# Altium schematic sheet SMI Bank 12.SchDoc
size A3; SheetNumber: 10; SheetTotal: 22
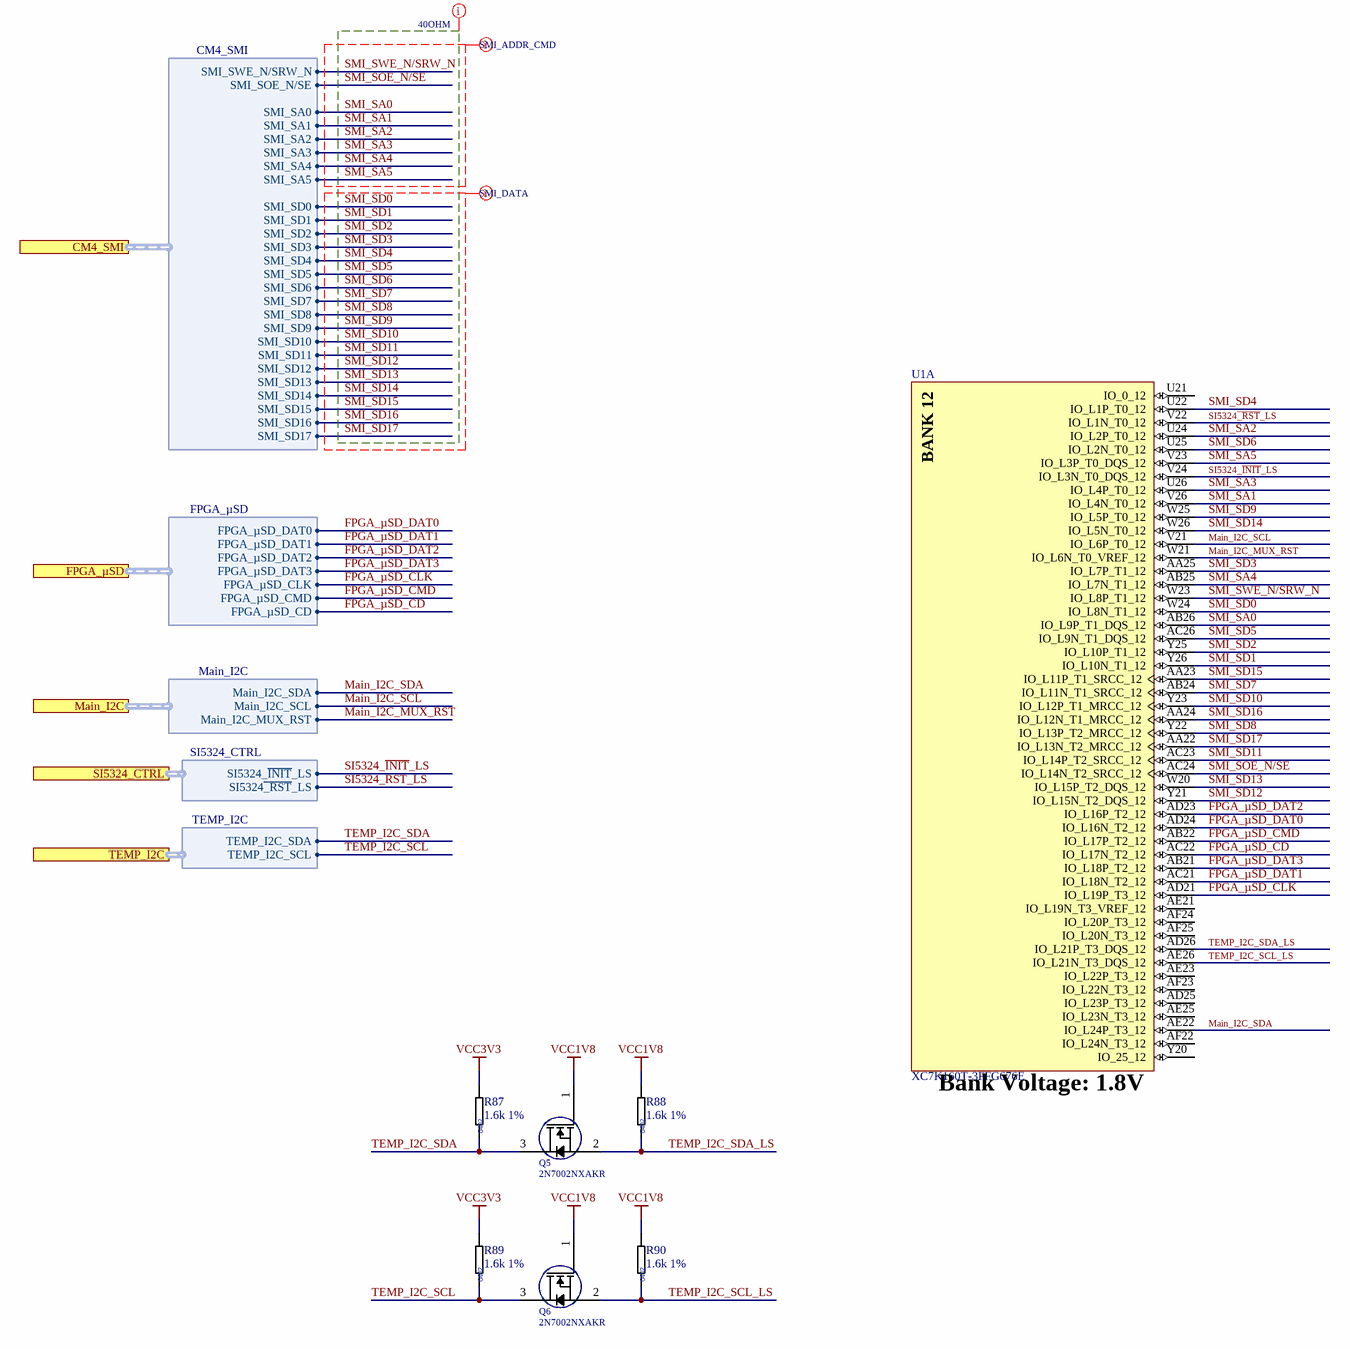
[diagram p0: SMI Bank 12.SchDoc]

## Parts
Q5  2N7002NXAKR  [SOT95P251X112-3N]
Q6  2N7002NXAKR  [SOT95P251X112-3N]
R87  1.6k 1%  [RES_0402_L]
R88  1.6k 1%  [RES_0402_L]
R89  1.6k 1%  [RES_0402_L]
R90  1.6k 1%  [RES_0402_L]
U1  XC7K160T-3FFG676E  [BGA100P2700X2700X317-676N]  (part A of 14)

## Ports
CM4_SMI (harness CM4_SMI, see Top-Level-Sheet[4B], Raspberry Pi CM4[8D]), FPGA_µSD (harness FPGA_µSD, see Top-Level-Sheet[4B], QSPI Flash_eMMC_uSD-Card[1C]), Main_I2C (harness Main_I2C, see Top-Level-Sheet[4B], I2C Multiplexer[1A]), SI5324_CTRL (harness SI5324_CTRL, see Top-Level-Sheet[4B], System Clocks[1A]), TEMP_I2C (harness TEMP_I2C, see Top-Level-Sheet[4B], Buck Modules[1D])

## Harnesses
CM4_SMI: SMI_SOE_N/SE, SMI_SA0, SMI_SD0, SMI_SWE_N/SRW_N, SMI_SA1, SMI_SA2, SMI_SA3, SMI_SA4, SMI_SA5, SMI_SD1, SMI_SD2, SMI_SD3, SMI_SD4, SMI_SD5, SMI_SD6, SMI_SD7, SMI_SD8, SMI_SD9, SMI_SD10, SMI_SD11, SMI_SD12, SMI_SD13, SMI_SD14, SMI_SD15, SMI_SD16, SMI_SD17
FPGA_µSD: FPGA_µSD_DAT0, FPGA_µSD_DAT1, FPGA_µSD_DAT3, FPGA_µSD_CLK, FPGA_µSD_CMD, FPGA_µSD_DAT2, FPGA_µSD_CD
Main_I2C: Main_I2C_SCL, Main_I2C_MUX_RST, Main_I2C_SDA
SI5324_CTRL: SI5324_~{INIT}_LS, SI5324~{_RST}_LS
TEMP_I2C: TEMP_I2C_SCL, TEMP_I2C_SDA

## Nets
VCC1V8: Q5.1(G) Q6.1(G) R88.2 R90.2
VCC3V3: R87.2 R89.2
FPGA_µSD_CD: U1.AC22(IO_L17N_T2_12) ; port FPGA_µSD.FPGA_µSD_CD
FPGA_µSD_CLK: U1.AD21(IO_L19P_T3_12) ; port FPGA_µSD.FPGA_µSD_CLK
FPGA_µSD_CMD: U1.AB22(IO_L17P_T2_12) ; port FPGA_µSD.FPGA_µSD_CMD
FPGA_µSD_DAT0: U1.AD24(IO_L16N_T2_12) ; port FPGA_µSD.FPGA_µSD_DAT0
FPGA_µSD_DAT1: U1.AC21(IO_L18N_T2_12) ; port FPGA_µSD.FPGA_µSD_DAT1
FPGA_µSD_DAT2: U1.AD23(IO_L16P_T2_12) ; port FPGA_µSD.FPGA_µSD_DAT2
FPGA_µSD_DAT3: U1.AB21(IO_L18P_T2_12) ; port FPGA_µSD.FPGA_µSD_DAT3
Main_I2C_MUX_RST: U1.W21(IO_L6N_T0_VREF_12) ; port Main_I2C.Main_I2C_MUX_RST
Main_I2C_SCL: U1.V21(IO_L6P_T0_12) ; port Main_I2C.Main_I2C_SCL
Main_I2C_SDA: U1.AE22(IO_L24P_T3_12) ; port Main_I2C.Main_I2C_SDA
SI5324~{_RST}_LS: U1.V22(IO_L1N_T0_12) ; port SI5324_CTRL.SI5324~{_RST}_LS
SI5324_~{INIT}_LS: U1.V24(IO_L3N_T0_DQS_12) ; port SI5324_CTRL.SI5324_~{INIT}_LS
SMI_SA0: U1.AB26(IO_L9P_T1_DQS_12) ; port CM4_SMI.SMI_SA0
SMI_SA1: U1.V26(IO_L4N_T0_12) ; port CM4_SMI.SMI_SA1
SMI_SA2: U1.U24(IO_L2P_T0_12) ; port CM4_SMI.SMI_SA2
SMI_SA3: U1.U26(IO_L4P_T0_12) ; port CM4_SMI.SMI_SA3
SMI_SA4: U1.AB25(IO_L7N_T1_12) ; port CM4_SMI.SMI_SA4
SMI_SA5: U1.V23(IO_L3P_T0_DQS_12) ; port CM4_SMI.SMI_SA5
SMI_SD0: U1.W24(IO_L8N_T1_12) ; port CM4_SMI.SMI_SD0
SMI_SD1: U1.Y26(IO_L10N_T1_12) ; port CM4_SMI.SMI_SD1
SMI_SD2: U1.Y25(IO_L10P_T1_12) ; port CM4_SMI.SMI_SD2
SMI_SD3: U1.AA25(IO_L7P_T1_12) ; port CM4_SMI.SMI_SD3
SMI_SD4: U1.U22(IO_L1P_T0_12) ; port CM4_SMI.SMI_SD4
SMI_SD5: U1.AC26(IO_L9N_T1_DQS_12) ; port CM4_SMI.SMI_SD5
SMI_SD6: U1.U25(IO_L2N_T0_12) ; port CM4_SMI.SMI_SD6
SMI_SD7: U1.AB24(IO_L11N_T1_SRCC_12) ; port CM4_SMI.SMI_SD7
SMI_SD8: U1.Y22(IO_L13P_T2_MRCC_12) ; port CM4_SMI.SMI_SD8
SMI_SD9: U1.W25(IO_L5P_T0_12) ; port CM4_SMI.SMI_SD9
SMI_SD10: U1.Y23(IO_L12P_T1_MRCC_12) ; port CM4_SMI.SMI_SD10
SMI_SD11: U1.AC23(IO_L14P_T2_SRCC_12) ; port CM4_SMI.SMI_SD11
SMI_SD12: U1.Y21(IO_L15N_T2_DQS_12) ; port CM4_SMI.SMI_SD12
SMI_SD13: U1.W20(IO_L15P_T2_DQS_12) ; port CM4_SMI.SMI_SD13
SMI_SD14: U1.W26(IO_L5N_T0_12) ; port CM4_SMI.SMI_SD14
SMI_SD15: U1.AA23(IO_L11P_T1_SRCC_12) ; port CM4_SMI.SMI_SD15
SMI_SD16: U1.AA24(IO_L12N_T1_MRCC_12) ; port CM4_SMI.SMI_SD16
SMI_SD17: U1.AA22(IO_L13N_T2_MRCC_12) ; port CM4_SMI.SMI_SD17
SMI_SOE_N/SE: U1.AC24(IO_L14N_T2_SRCC_12) ; port CM4_SMI.SMI_SOE_N/SE
SMI_SWE_N/SRW_N: U1.W23(IO_L8P_T1_12) ; port CM4_SMI.SMI_SWE_N/SRW_N
TEMP_I2C_SCL: Q6.3(D) R89.1 ; port TEMP_I2C.TEMP_I2C_SCL
TEMP_I2C_SCL_LS: Q6.2(S) R90.1 U1.AE26(IO_L21N_T3_DQS_12)
TEMP_I2C_SDA: Q5.3(D) R87.1 ; port TEMP_I2C.TEMP_I2C_SDA
TEMP_I2C_SDA_LS: Q5.2(S) R88.1 U1.AD26(IO_L21P_T3_DQS_12)

Not connected (* = marked no-connect by the designer): U1 AD25(IO_L23P_T3_12) AE21(IO_L19N_T3_VREF_12) AE23(IO_L22P_T3_12) AE25(IO_L23N_T3_12) AF22(IO_L24N_T3_12) AF23(IO_L22N_T3_12) AF24(IO_L20P_T3_12) AF25(IO_L20N_T3_12) U21(IO_0_12) Y20(IO_25_12)

## Layout directives
net class SMI_ADDR_CMD: SMI_SA0, SMI_SA1, SMI_SA2, SMI_SA3, SMI_SA4, SMI_SA5, SMI_SOE_N/SE, SMI_SWE_N/SRW_N
net class SMI_DATA: SMI_SD0, SMI_SD1, SMI_SD2, SMI_SD3, SMI_SD4, SMI_SD5, SMI_SD6, SMI_SD7, SMI_SD8, SMI_SD9, SMI_SD10, SMI_SD11, SMI_SD12, SMI_SD13, SMI_SD14, SMI_SD15, SMI_SD16, SMI_SD17
net class 40OHM: SMI_SA0, SMI_SA1, SMI_SA2, SMI_SA3, SMI_SA4, SMI_SA5, SMI_SD0, SMI_SD1, SMI_SD2, SMI_SD3, SMI_SD4, SMI_SD5, SMI_SD6, SMI_SD7, SMI_SD8, SMI_SD9, SMI_SD10, SMI_SD11, SMI_SD12, SMI_SD13, SMI_SD14, SMI_SD15, SMI_SD16, SMI_SD17, SMI_SOE_N/SE, SMI_SWE_N/SRW_N

## Notes on the sheet
- (near U1) Bank Voltage: 1.8V
- Title:
- ++CONFIDENTIAL++
- Datum:
- Blatt:
- von:
- Zeit:
- Entwickler:
- Elektronik- und Softwareentwicklung aus Nürnberg
- The  information  contained  in  these  documents  is  confidential,  privileged  and  only  for  the
  information of the intended recipient and may
  not be used, published or redistributed without
  the prior written consent from PCB Arts GmbH.
- Revision:
- Checked:
- https://pcb-arts.com/
- mail@pcb-arts.com
- (in symbol RES_0402_1.6k_1%) 0402
- (in symbol XC7K160T-3FFG676E_Kintex-7 FPGA, 400 User I/Os, 8 GTX, FFG676, part A) BANK 12

## Library data of the parts
Q5 Q6 = 2N7002NXAKR_MOSFET 60V SGL N-CH TRENCHMOS: MOSFET 60V SGL N-CH TRENCHMOS; Manufacturer 1: Nexperia; Manufacturer 1 Prt. Nr.: 2N7002NXAKR
R87-R90 = RES_0402_1.6k_1%: Thick Film Resistors - SMD 1.6kOhm 1%; Manufacturer 1: Vishay / Dale; Manufacturer 1 Prt. Nr.: CRCW04021K60FKEDC; Manufacturer 2 Prt. Nr.: RC0402FR-7W1K6L; Manufacturer 2: Yageo
U1 = XC7K160T-3FFG676E_Kintex-7 FPGA, 400 User I/Os, 8 GTX, FFG676: Kintex-7 FPGA, 400 User I/Os, 8 GTX, 676-Ball BGA, Speed Grade 3, Extended Grade, Pb-Free; Manufacturer 1: Xilinx; Manufacturer 1 Prt. Nr.: XC7K160T-3FFG676E; ComponentLink1URL: http://www.xilinx.com/support/documentation/data_sheets/ds180_7Series_Overview.pdf; ComponentLink2URL: http://www.xilinx.com/support/documentation/user_guides/ug865-Zynq-7000-Pkg-Pinout.pdf; ComponentLink1Description: Datasheet; ComponentLink2Description: Package Specification